# Altium schematic sheet TCRT5000.SchDoc
size A3
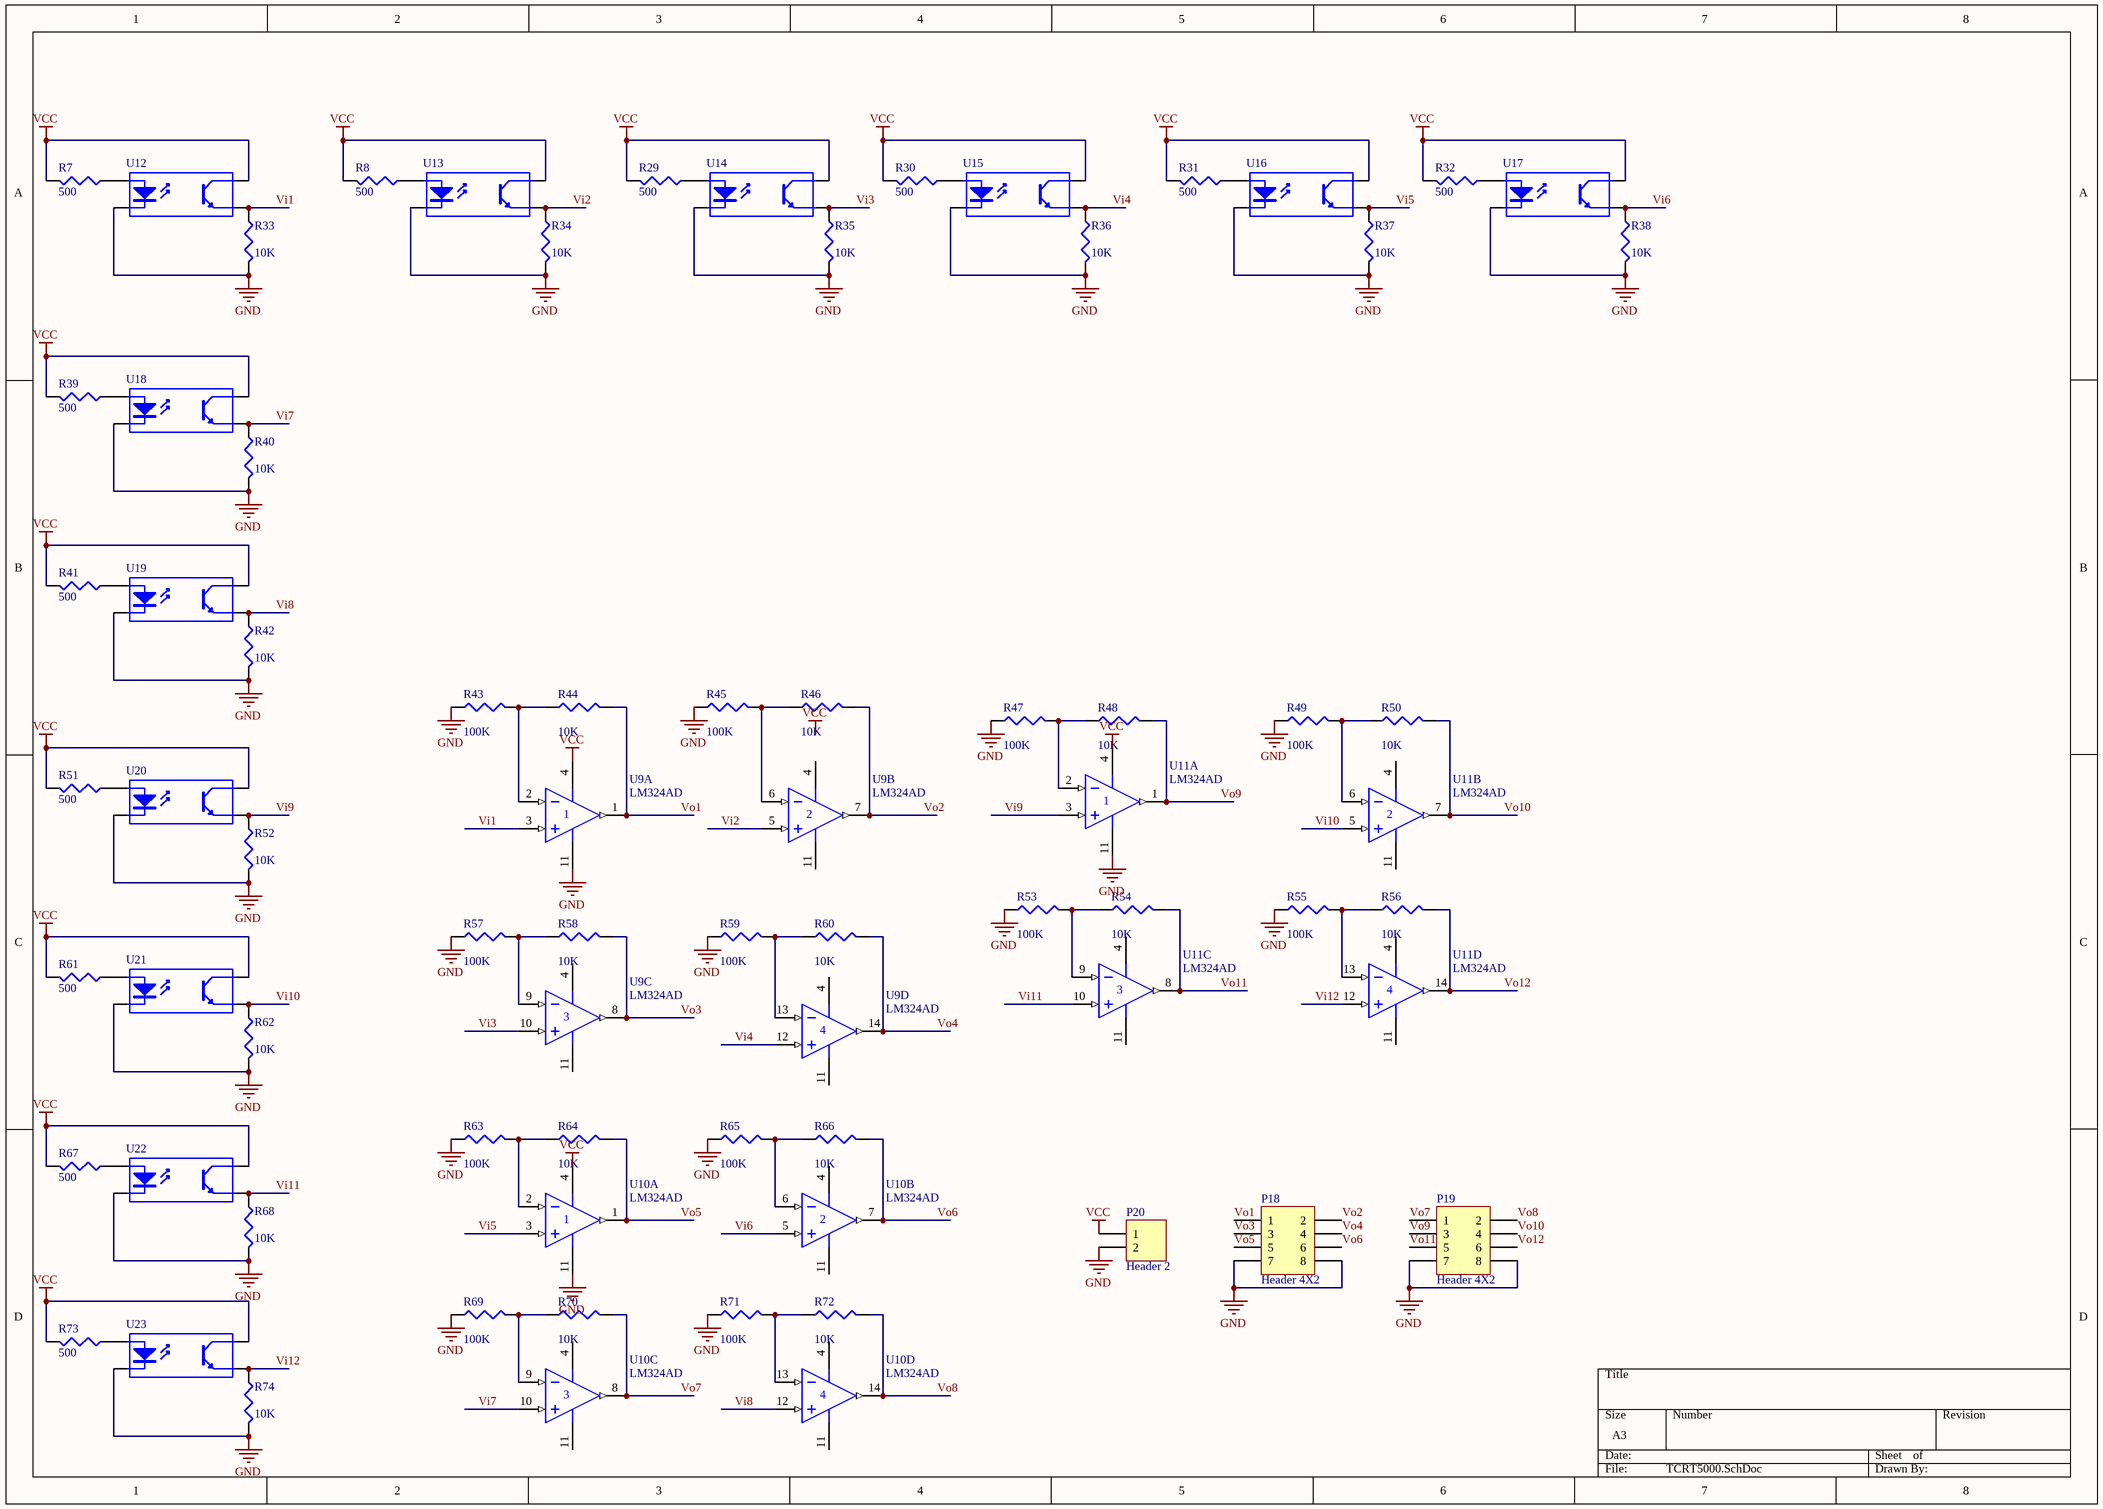
[diagram p0: TCRT5000.SchDoc]

## Parts
P18  Header 4X2  [HDR2X4]
P19  Header 4X2  [HDR2X4]
P20  Header 2  [HDR1X2]
R7  value 500  [0603]  (hidden comment: Res3)
R8  value 500  [0603]  (hidden comment: Res3)
R29  value 500  [0603]  (hidden comment: Res3)
R30  value 500  [0603]  (hidden comment: Res3)
R31  value 500  [0603]  (hidden comment: Res3)
R32  value 500  [0603]  (hidden comment: Res3)
R33  value 10K  [0603]  (hidden comment: Res3)
R34  value 10K  [0603]  (hidden comment: Res3)
R35  value 10K  [0603]  (hidden comment: Res3)
R36  value 10K  [0603]  (hidden comment: Res3)
R37  value 10K  [0603]  (hidden comment: Res3)
R38  value 10K  [0603]  (hidden comment: Res3)
R39  value 500  [0603]  (hidden comment: Res3)
R40  value 10K  [0603]  (hidden comment: Res3)
R41  value 500  [0603]  (hidden comment: Res3)
R42  value 10K  [0603]  (hidden comment: Res3)
R43  value 100K  [0603]  (hidden comment: Res3)
R44  value 10K  [0603]  (hidden comment: Res3)
R45  value 100K  [0603]  (hidden comment: Res3)
R46  value 10K  [0603]  (hidden comment: Res3)
R47  value 100K  [0603]  (hidden comment: Res3)
R48  value 10K  [0603]  (hidden comment: Res3)
R49  value 100K  [0603]  (hidden comment: Res3)
R50  value 10K  [0603]  (hidden comment: Res3)
R51  value 500  [0603]  (hidden comment: Res3)
R52  value 10K  [0603]  (hidden comment: Res3)
R53  value 100K  [0603]  (hidden comment: Res3)
R54  value 10K  [0603]  (hidden comment: Res3)
R55  value 100K  [0603]  (hidden comment: Res3)
R56  value 10K  [0603]  (hidden comment: Res3)
R57  value 100K  [0603]  (hidden comment: Res3)
R58  value 10K  [0603]  (hidden comment: Res3)
R59  value 100K  [0603]  (hidden comment: Res3)
R60  value 10K  [0603]  (hidden comment: Res3)
R61  value 500  [0603]  (hidden comment: Res3)
R62  value 10K  [0603]  (hidden comment: Res3)
R63  value 100K  [0603]  (hidden comment: Res3)
R64  value 10K  [0603]  (hidden comment: Res3)
R65  value 100K  [0603]  (hidden comment: Res3)
R66  value 10K  [0603]  (hidden comment: Res3)
R67  value 500  [0603]  (hidden comment: Res3)
R68  value 10K  [0603]  (hidden comment: Res3)
R69  value 100K  [0603]  (hidden comment: Res3)
R70  value 10K  [0603]  (hidden comment: Res3)
R71  value 100K  [0603]  (hidden comment: Res3)
R72  value 10K  [0603]  (hidden comment: Res3)
R73  value 500  [0603]  (hidden comment: Res3)
R74  value 10K  [0603]  (hidden comment: Res3)
U9  LM324AD  [D014_N]  (parts A,B,C,D of 4)
U10  LM324AD  [D014_N]  (parts A,B,C,D of 4)
U11  LM324AD  [D014_N]  (parts A,B,C,D of 4)
U12  Optoisolator1  [TCRT5000]  (value not drawn)
U13  Optoisolator1  [TCRT5000]  (value not drawn)
U14  Optoisolator1  [TCRT5000]  (value not drawn)
U15  Optoisolator1  [TCRT5000]  (value not drawn)
U16  Optoisolator1  [TCRT5000]  (value not drawn)
U17  Optoisolator1  [TCRT5000]  (value not drawn)
U18  Optoisolator1  [TCRT5000]  (value not drawn)
U19  Optoisolator1  [TCRT5000]  (value not drawn)
U20  Optoisolator1  [TCRT5000]  (value not drawn)
U21  Optoisolator1  [TCRT5000]  (value not drawn)
U22  Optoisolator1  [TCRT5000]  (value not drawn)
U23  Optoisolator1  [TCRT5000]  (value not drawn)

## Nets
GND: P18.7 P18.8 P19.7 P19.8 P20.2 R33.2 R34.2 R35.2 R36.2 R37.2 R38.2 R40.2 R42.2 R43.1 R45.1 R47.1 R49.1 R52.2 R53.1 R55.1 R57.1 R59.1 R62.2 R63.1 R65.1 R68.2 R69.1 R71.1 R74.2 U9.11(V-) U10.11(V-) U11.11(V-) U12.2(K) U13.2(K) U14.2(K) U15.2(K) U16.2(K) U17.2(K) U18.2(K) U19.2(K) U20.2(K) U21.2(K) U22.2(K) U23.2(K)
VCC: P20.1 R7.2 R8.2 R29.2 R30.2 R31.2 R32.2 R39.2 R41.2 R51.2 R61.2 R67.2 R73.2 U9.4(V+) U10.4(V+) U11.4(V+) U12.4(C) U13.4(C) U14.4(C) U15.4(C) U16.4(C) U17.4(C) U18.4(C) U19.4(C) U20.4(C) U21.4(C) U22.4(C) U23.4(C)
Vi1: R33.1 U9.3(IN+) U12.3(E)
Vi2: R34.1 U9.5(IN+) U13.3(E)
Vi3: R35.1 U9.10(IN+) U14.3(E)
Vi4: R36.1 U9.12(IN+) U15.3(E)
Vi5: R37.1 U10.3(IN+) U16.3(E)
Vi6: R38.1 U10.5(IN+) U17.3(E)
Vi7: R40.1 U10.10(IN+) U18.3(E)
Vi8: R42.1 U10.12(IN+) U19.3(E)
Vi9: R52.1 U11.3(IN+) U20.3(E)
Vi10: R62.1 U11.5(IN+) U21.3(E)
Vi11: R68.1 U11.10(IN+) U22.3(E)
Vi12: R74.1 U11.12(IN+) U23.3(E)
Vo1: P18.1 R44.2 U9.1(OUT)
Vo2: P18.2 R46.2 U9.7(OUT)
Vo3: P18.3 R58.2 U9.8(OUT)
Vo4: P18.4 R60.2 U9.14(OUT)
Vo5: P18.5 R64.2 U10.1(OUT)
Vo6: P18.6 R66.2 U10.7(OUT)
Vo7: P19.1 R70.2 U10.8(OUT)
Vo8: P19.2 R72.2 U10.14(OUT)
Vo9: P19.3 R48.2 U11.1(OUT)
Vo10: P19.4 R50.2 U11.7(OUT)
Vo11: P19.5 R54.2 U11.8(OUT)
Vo12: P19.6 R56.2 U11.14(OUT)
NetR7_1: R7.1 U12.1(A)
NetR8_1: R8.1 U13.1(A)
NetR29_1: R29.1 U14.1(A)
NetR30_1: R30.1 U15.1(A)
NetR31_1: R31.1 U16.1(A)
NetR32_1: R32.1 U17.1(A)
NetR39_1: R39.1 U18.1(A)
NetR41_1: R41.1 U19.1(A)
NetR43_2: R43.2 R44.1 U9.2(IN-)
NetR45_2: R45.2 R46.1 U9.6(IN-)
NetR47_2: R47.2 R48.1 U11.2(IN-)
NetR49_2: R49.2 R50.1 U11.6(IN-)
NetR51_1: R51.1 U20.1(A)
NetR53_2: R53.2 R54.1 U11.9(IN-)
NetR55_2: R55.2 R56.1 U11.13(IN-)
NetR57_2: R57.2 R58.1 U9.9(IN-)
NetR59_2: R59.2 R60.1 U9.13(IN-)
NetR61_1: R61.1 U21.1(A)
NetR63_2: R63.2 R64.1 U10.2(IN-)
NetR65_2: R65.2 R66.1 U10.6(IN-)
NetR67_1: R67.1 U22.1(A)
NetR69_2: R69.2 R70.1 U10.9(IN-)
NetR71_2: R71.2 R72.1 U10.13(IN-)
NetR73_1: R73.1 U23.1(A)

## Notes on the sheet
- Labels drawn without touching a wire or pin: VCC

## Library data of the parts
P18 P19 = Header 4X2: Header, 4-Pin, Dual row; LatestRevisionDate: 17-Jul-2002; LatestRevisionNote: Re-released for DXP Platform.; Publisher: Altium Limited
P20 = Header 2: Header, 2-Pin; LatestRevisionDate: 17-Jul-2002; LatestRevisionNote: Re-released for DXP Platform.; Publisher: Altium Limited
R7 R8 R29-R74 = Res3: Resistor; Published: 8-Jun-2000; LatestRevisionDate: 29-May-2009; LatestRevisionNote: IPC-7351 Footprint Added.; PackageReference: J1-0603; Publisher: Altium Limited; PackageDescription: Chip Resistor
U9-U11 = LM324AD: Quadruple Operational Amplifier; Published: 15-Apr-2002; LatestRevisionDate: 13-Apr-2006; LatestRevisionNote: IPC-7351 Footprint Added.; DatasheetVersion: Jan-1989; PackageVersion: Jan-1998; PackageReference: D014; Publisher: Altium Limited; PackageDescription: 14-Pin Small Outline Integrated Circuit 1.27 mm Pitch; Code_IPC: SOIC127P600-14; ComponentLink1Description: Manufacturer Link; ComponentLink1URL: http://www.ti.com/; ComponentLink2Description: Datasheet; ComponentLink2URL: http://www-s.ti.com/sc/ds/lm324.pdf
U12-U23 = Optoisolator1: 4-Pin Phototransistor Optocoupler; Published: 24-Mar-1999; LatestRevisionDate: 04-Mar-2005; LatestRevisionNote: Sch pins 3 & 4 Swapped.; DatasheetVersion: Nov-2003; PackageReference: DIP-4; Publisher: Altium Limited